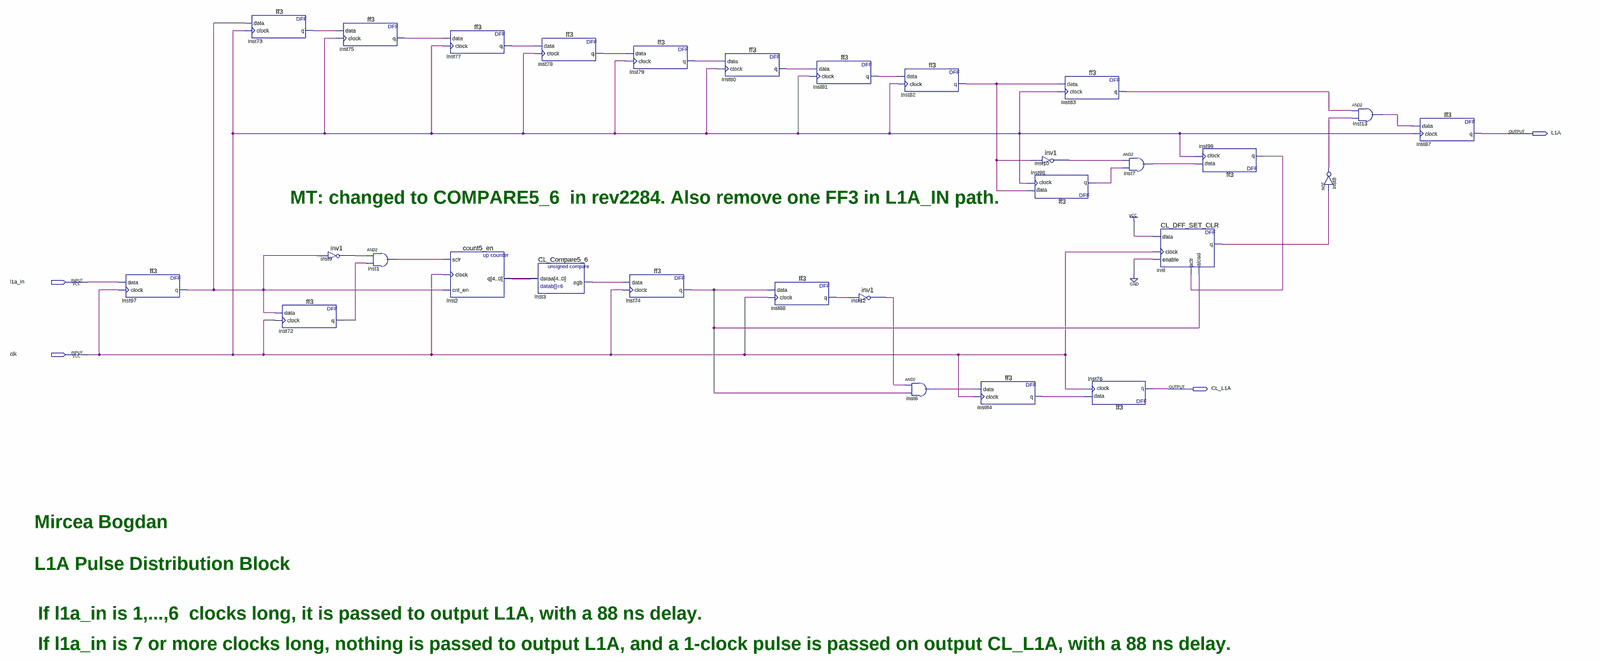
[diagram p0: schematic sheet, whole]
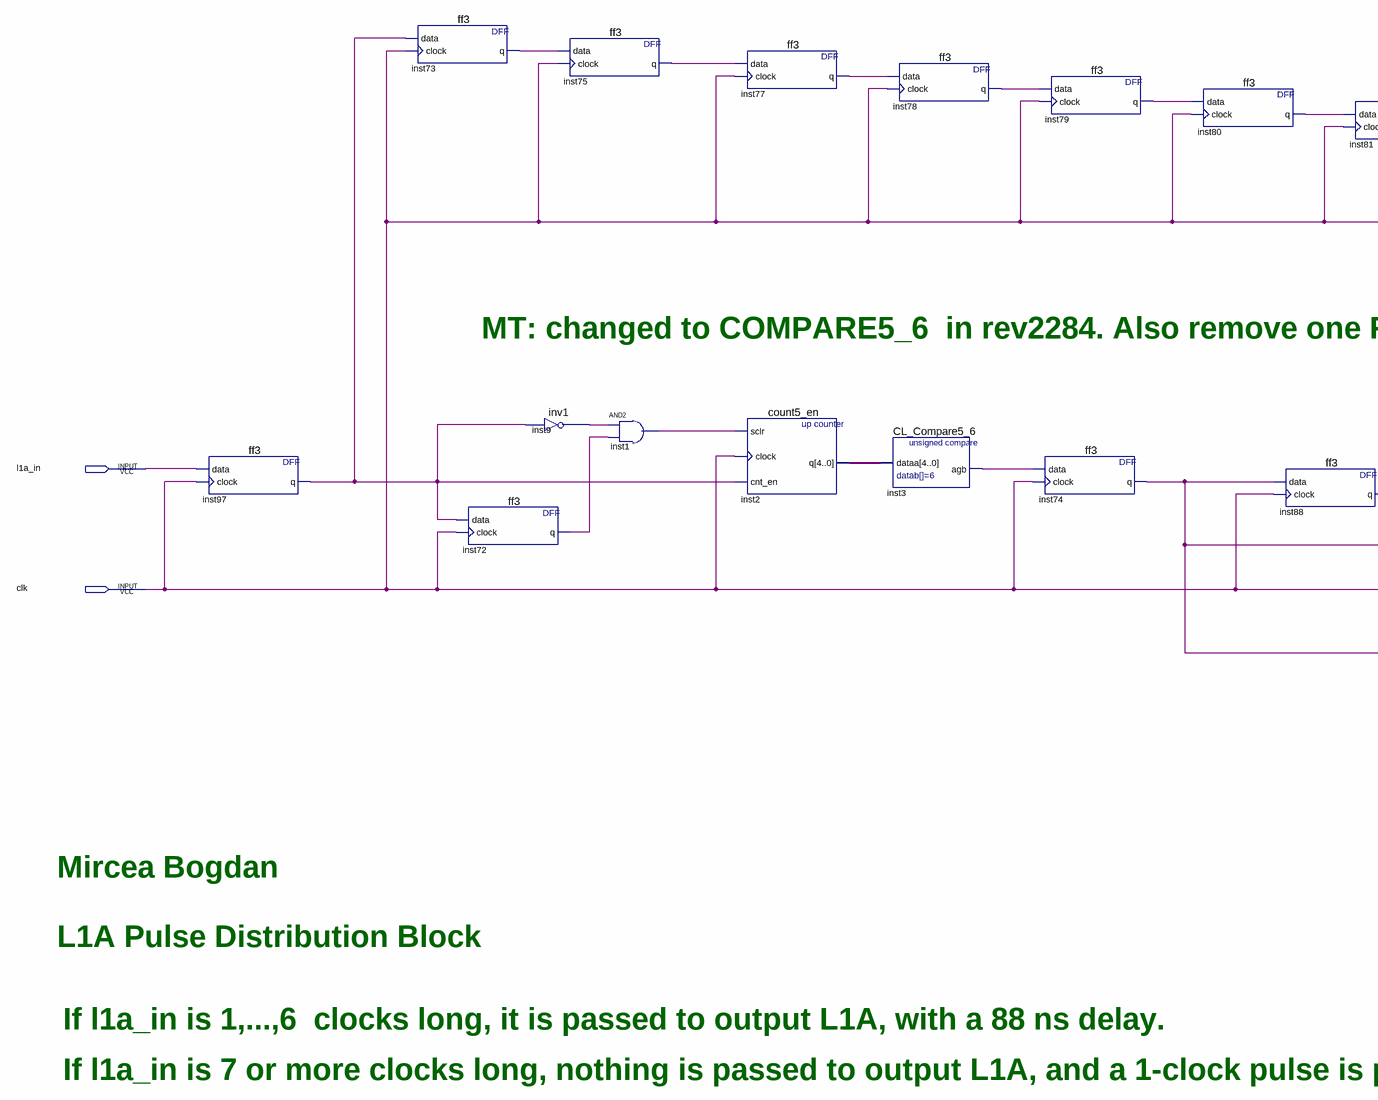
[diagram p1: schematic sheet, left part]
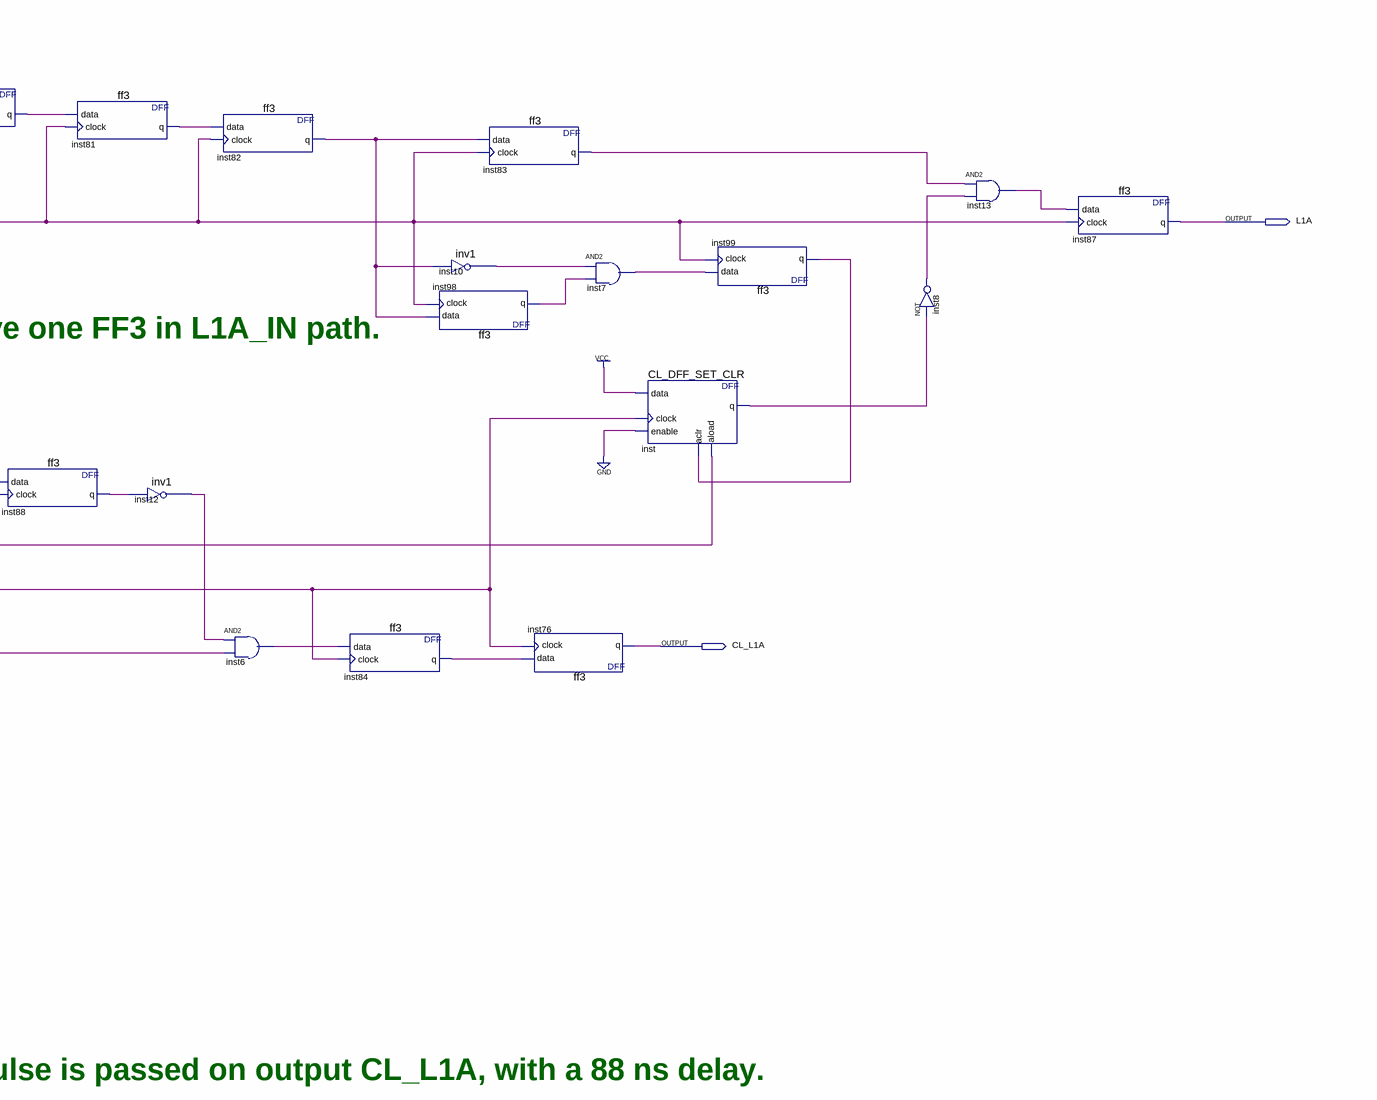
[diagram p2: schematic sheet, right part]
// Quartus schematic CL_L1A_Buff.bdf as structural Verilog: 29 symbols, 4 pins
module CL_L1A_Buff (
  input  l1a_in,
  input  clk,
  output L1A,
  output CL_L1A
);

  wire inst1_out, inst3_agb, inst6_out, inst7_out, inst8_out, inst9_result, inst10_result, inst12_result,
       inst13_out, inst72_q, inst73_q, inst74_q, inst75_q, inst77_q, inst78_q, inst79_q, inst80_q, inst81_q,
       inst82_q, inst83_q, inst84_q, inst88_q, inst97_q, inst98_q, inst99_q, inst_q;
  wire [4:0] inst2_q;

  ff3 inst97 (.data(l1a_in), .clock(clk), .q(inst97_q));
  ff3 inst73 (.data(inst97_q), .clock(clk), .q(inst73_q));
  ff3 inst72 (.data(inst97_q), .clock(clk), .q(inst72_q));
  inv1 inst9 (.data(inst97_q), .result(inst9_result));
  ff3 inst75 (.data(inst73_q), .clock(clk), .q(inst75_q));
  and inst1 (inst1_out, inst9_result, inst72_q);
  ff3 inst77 (.data(inst75_q), .clock(clk), .q(inst77_q));
  count5_en inst2 (.sclr(inst1_out), .clock(clk), .cnt_en(inst97_q), .q(inst2_q));
  ff3 inst78 (.data(inst77_q), .clock(clk), .q(inst78_q));
  CL_Compare5_6 inst3 (.dataa(inst2_q), .agb(inst3_agb));
  ff3 inst79 (.data(inst78_q), .clock(clk), .q(inst79_q));
  ff3 inst74 (.data(inst3_agb), .clock(clk), .q(inst74_q));
  ff3 inst80 (.data(inst79_q), .clock(clk), .q(inst80_q));
  ff3 inst88 (.data(inst74_q), .clock(clk), .q(inst88_q));
  ff3 inst81 (.data(inst80_q), .clock(clk), .q(inst81_q));
  inv1 inst12 (.data(inst88_q), .result(inst12_result));
  ff3 inst82 (.data(inst81_q), .clock(clk), .q(inst82_q));
  and inst6 (inst6_out, inst12_result, inst74_q);
  ff3 inst84 (.data(inst6_out), .clock(clk), .q(inst84_q));
  inv1 inst10 (.data(inst82_q), .result(inst10_result));
  ff3 inst98 (.data(inst82_q), .clock(clk), .q(inst98_q));
  ff3 inst83 (.data(inst82_q), .clock(clk), .q(inst83_q));
  ff3 inst76 (.data(inst84_q), .clock(clk), .q(CL_L1A));
  and inst7 (inst7_out, inst10_result, inst98_q);
  CL_DFF_SET_CLR inst (.data(1'b1), .clock(clk), .enable(1'b0), .aclr(inst99_q), .aload(inst74_q), .q(inst_q));
  ff3 inst99 (.data(inst7_out), .clock(clk), .q(inst99_q));
  not inst8 (inst8_out, inst_q);
  and inst13 (inst13_out, inst83_q, inst8_out);
  ff3 inst87 (.data(inst13_out), .clock(clk), .q(L1A));

  // Notes on the sheet:
  //   MT: changed to COMPARE5_6  in rev2284. Also remove one FF3 in L1A_IN path.
  //   Mircea Bogdan
  //   L1A Pulse Distribution Block
  //   If l1a_in is 1,...,6  clocks long, it is passed to output L1A, with a 88 ns delay.
  //   If l1a_in is 7 or more clocks long, nothing is passed to output L1A, and a 1-clock pulse is passed on output CL_L1A, with a 88 ns delay.
endmodule
